# Altium schematic sheet 01_Fly-Balance.SchDoc
size A4; CheckedBy: <审核日期>; Author: llm; CompanyName: 孔乙己图书店; DocumentNumber: 1; SheetNumber: 1; SheetTotal: 6; PageSetup: Record=PageOptions|CenterHorizontal=True|CenterVertical=True|PrintScale=1.00|XCorrection=1.00|YCorrection=1.00|PrintKind=0|BorderSize=5000000|LeftOffset=0|BottomOffset=0|Orientation=2|PaperLength=1000|PaperWidth=1000|Scale=100|PaperSource=7|PrintQuality=600|MediaType=1|DitherType=10|PaperKind=A4|PrintScaleMode=1; DesignDate: <设计日期>; CheckDate: <审核人员>; SheetName: Fly-Balance; SheetVersion: Rev.F; SheetDescription: <图纸描述>; productName: Fly-Balance
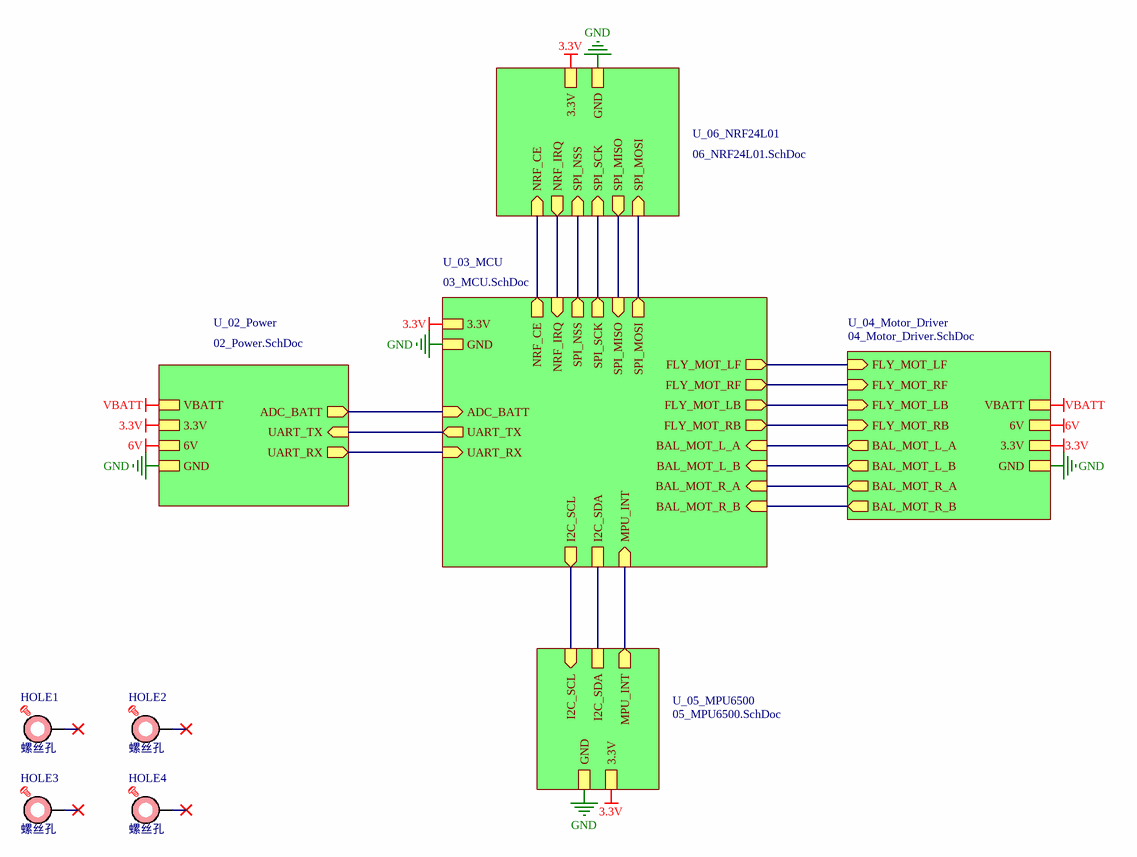
[diagram p0: 01_Fly-Balance.SchDoc]

## Parts
HOLE1  螺丝孔  [HOLE-2.2]  (no BOM)
HOLE2  螺丝孔  [HOLE-2.2]  (no BOM)
HOLE3  螺丝孔  [HOLE-2.2]  (no BOM)
HOLE4  螺丝孔  [HOLE-2.2]  (no BOM)

## Sub-sheets
U_02_Power = 02_Power.SchDoc: 3.3V, GND, VBATT, ADC_BATT (out), UART_TX (in), UART_RX (out), 6V
U_03_MCU = 03_MCU.SchDoc: 3.3V, GND, FLY_MOT_LF (out), FLY_MOT_RF (out), FLY_MOT_LB (out), FLY_MOT_RB (out), MPU_INT (in), I2C_SCL (out), I2C_SDA, NRF_IRQ (in), NRF_CE (out), SPI_NSS (out), SPI_SCK (out), SPI_MISO (in), SPI_MOSI (out), ADC_BATT (in), UART_TX (out), UART_RX (in), BAL_MOT_R_A (in), BAL_MOT_L_A (in), BAL_MOT_R_B (in), BAL_MOT_L_B (in)
U_04_Motor_Driver = 04_Motor_Driver.SchDoc: FLY_MOT_LF (in), FLY_MOT_RF (in), FLY_MOT_LB (in), FLY_MOT_RB (in), VBATT, GND, 6V, BAL_MOT_R_B (out), BAL_MOT_L_A (out), BAL_MOT_L_B (out), BAL_MOT_R_A (out), 3.3V
U_05_MPU6500 = 05_MPU6500.SchDoc: 3.3V, GND, MPU_INT (out), I2C_SCL (in), I2C_SDA
U_06_NRF24L01 = 06_NRF24L01.SchDoc: NRF_IRQ (out), NRF_CE (in), SPI_NSS (in), SPI_SCK (in), SPI_MISO (out), SPI_MOSI (in), 3.3V, GND

## Nets
3.3V: sheet U_02_Power/3.3V, sheet U_03_MCU/3.3V, sheet U_06_NRF24L01/3.3V, sheet U_04_Motor_Driver/3.3V, sheet U_05_MPU6500/3.3V
6V: sheet U_02_Power/6V, sheet U_04_Motor_Driver/6V
GND: sheet U_02_Power/GND, sheet U_03_MCU/GND, sheet U_06_NRF24L01/GND, sheet U_04_Motor_Driver/GND, sheet U_05_MPU6500/GND
VBATT: sheet U_02_Power/VBATT, sheet U_04_Motor_Driver/VBATT
(unnamed): sheet U_02_Power/ADC_BATT, sheet U_03_MCU/ADC_BATT
(unnamed): sheet U_02_Power/UART_TX, sheet U_03_MCU/UART_TX
(unnamed): sheet U_02_Power/UART_RX, sheet U_03_MCU/UART_RX
(unnamed): sheet U_03_MCU/FLY_MOT_LF, sheet U_04_Motor_Driver/FLY_MOT_LF
(unnamed): sheet U_03_MCU/FLY_MOT_RF, sheet U_04_Motor_Driver/FLY_MOT_RF
(unnamed): sheet U_03_MCU/FLY_MOT_LB, sheet U_04_Motor_Driver/FLY_MOT_LB
(unnamed): sheet U_03_MCU/FLY_MOT_RB, sheet U_04_Motor_Driver/FLY_MOT_RB
(unnamed): sheet U_03_MCU/MPU_INT, sheet U_05_MPU6500/MPU_INT
(unnamed): sheet U_03_MCU/I2C_SCL, sheet U_05_MPU6500/I2C_SCL
(unnamed): sheet U_03_MCU/I2C_SDA, sheet U_05_MPU6500/I2C_SDA
(unnamed): sheet U_03_MCU/NRF_IRQ, sheet U_06_NRF24L01/NRF_IRQ
(unnamed): sheet U_03_MCU/NRF_CE, sheet U_06_NRF24L01/NRF_CE
(unnamed): sheet U_03_MCU/SPI_NSS, sheet U_06_NRF24L01/SPI_NSS
(unnamed): sheet U_03_MCU/SPI_SCK, sheet U_06_NRF24L01/SPI_SCK
(unnamed): sheet U_03_MCU/SPI_MISO, sheet U_06_NRF24L01/SPI_MISO
(unnamed): sheet U_03_MCU/SPI_MOSI, sheet U_06_NRF24L01/SPI_MOSI
(unnamed): sheet U_03_MCU/BAL_MOT_R_A, sheet U_04_Motor_Driver/BAL_MOT_R_A
(unnamed): sheet U_03_MCU/BAL_MOT_L_A, sheet U_04_Motor_Driver/BAL_MOT_L_A
(unnamed): sheet U_03_MCU/BAL_MOT_R_B, sheet U_04_Motor_Driver/BAL_MOT_R_B
(unnamed): sheet U_03_MCU/BAL_MOT_L_B, sheet U_04_Motor_Driver/BAL_MOT_L_B

Not connected (* = marked no-connect by the designer): HOLE1 1*; HOLE2 1*; HOLE3 1*; HOLE4 1*

## Notes on the sheet
- 1
- #
- 修改日期
- 修改内容
- 2
- 3
- 设计人员
- 审核人员
- 设计日期
- 审核日期
- 产品名称
- 图纸名称
- 产品型号
- 图纸描述
- 图纸版本
- A4

## Library data of the parts
HOLE1-HOLE4 = HOLE - 螺丝孔